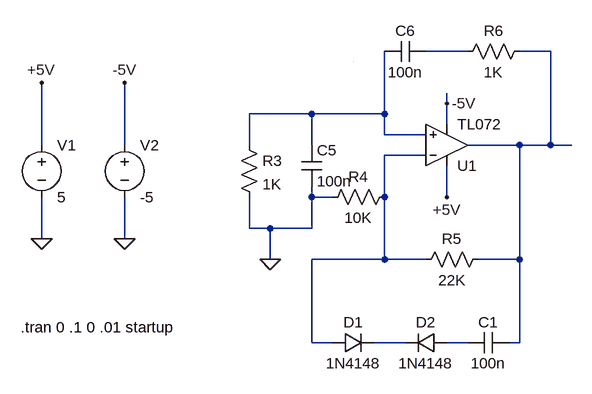
[diagram p0: schematic miniEC_WienBridge_Series.asc]
* miniEC_WienBridge_Series.asc
R3 N003 0 1K
R6 N002 N001 1K
R4 N004 0 10K
R5 N002 N004 22K
C5 N003 0 100n
C6 N001 N003 100n
V1 +5V 0 5
V2 -5V 0 -5
C1 N002 N006 100n
* U1: TL072 (symbol TL072 not available, pins judged from their places): In+=N003 In-=N004 V+=+5V V-=-5V OUT=N002
D1 N004 N005 1N4148
D2 N006 N005 1N4148
.model D D
.lib standard.dio
.tran 0 .1 0 .01 startup
.backanno
.end

* Results of the author's LTspice run, read from the files saved beside the schematic
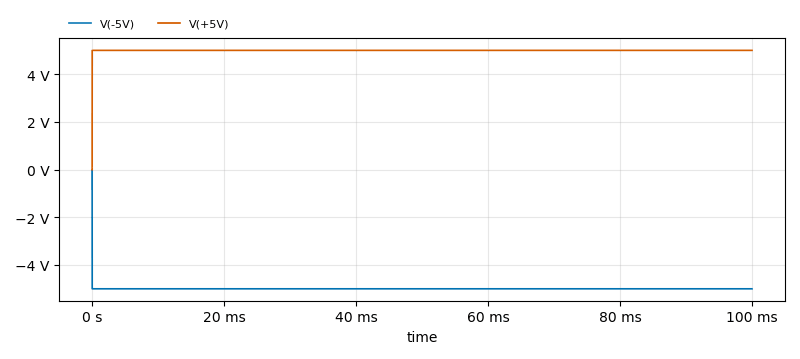
[diagram p1: Transient Analysis of miniEC_WienBridge_Series.asc, plotted from the saved traces]
* Transient Analysis, 1 run:
*   V(-5V): min -5 V, max 0 V, average -4.999 V, rms 5 V, last -5 V
*   V(+5V): min 0 V, max 5 V, average 4.999 V, rms 5 V, last 5 V